# EAGLE design 8bitBusConcept (EAGLE 6.0)

## Sheet 1 of 2
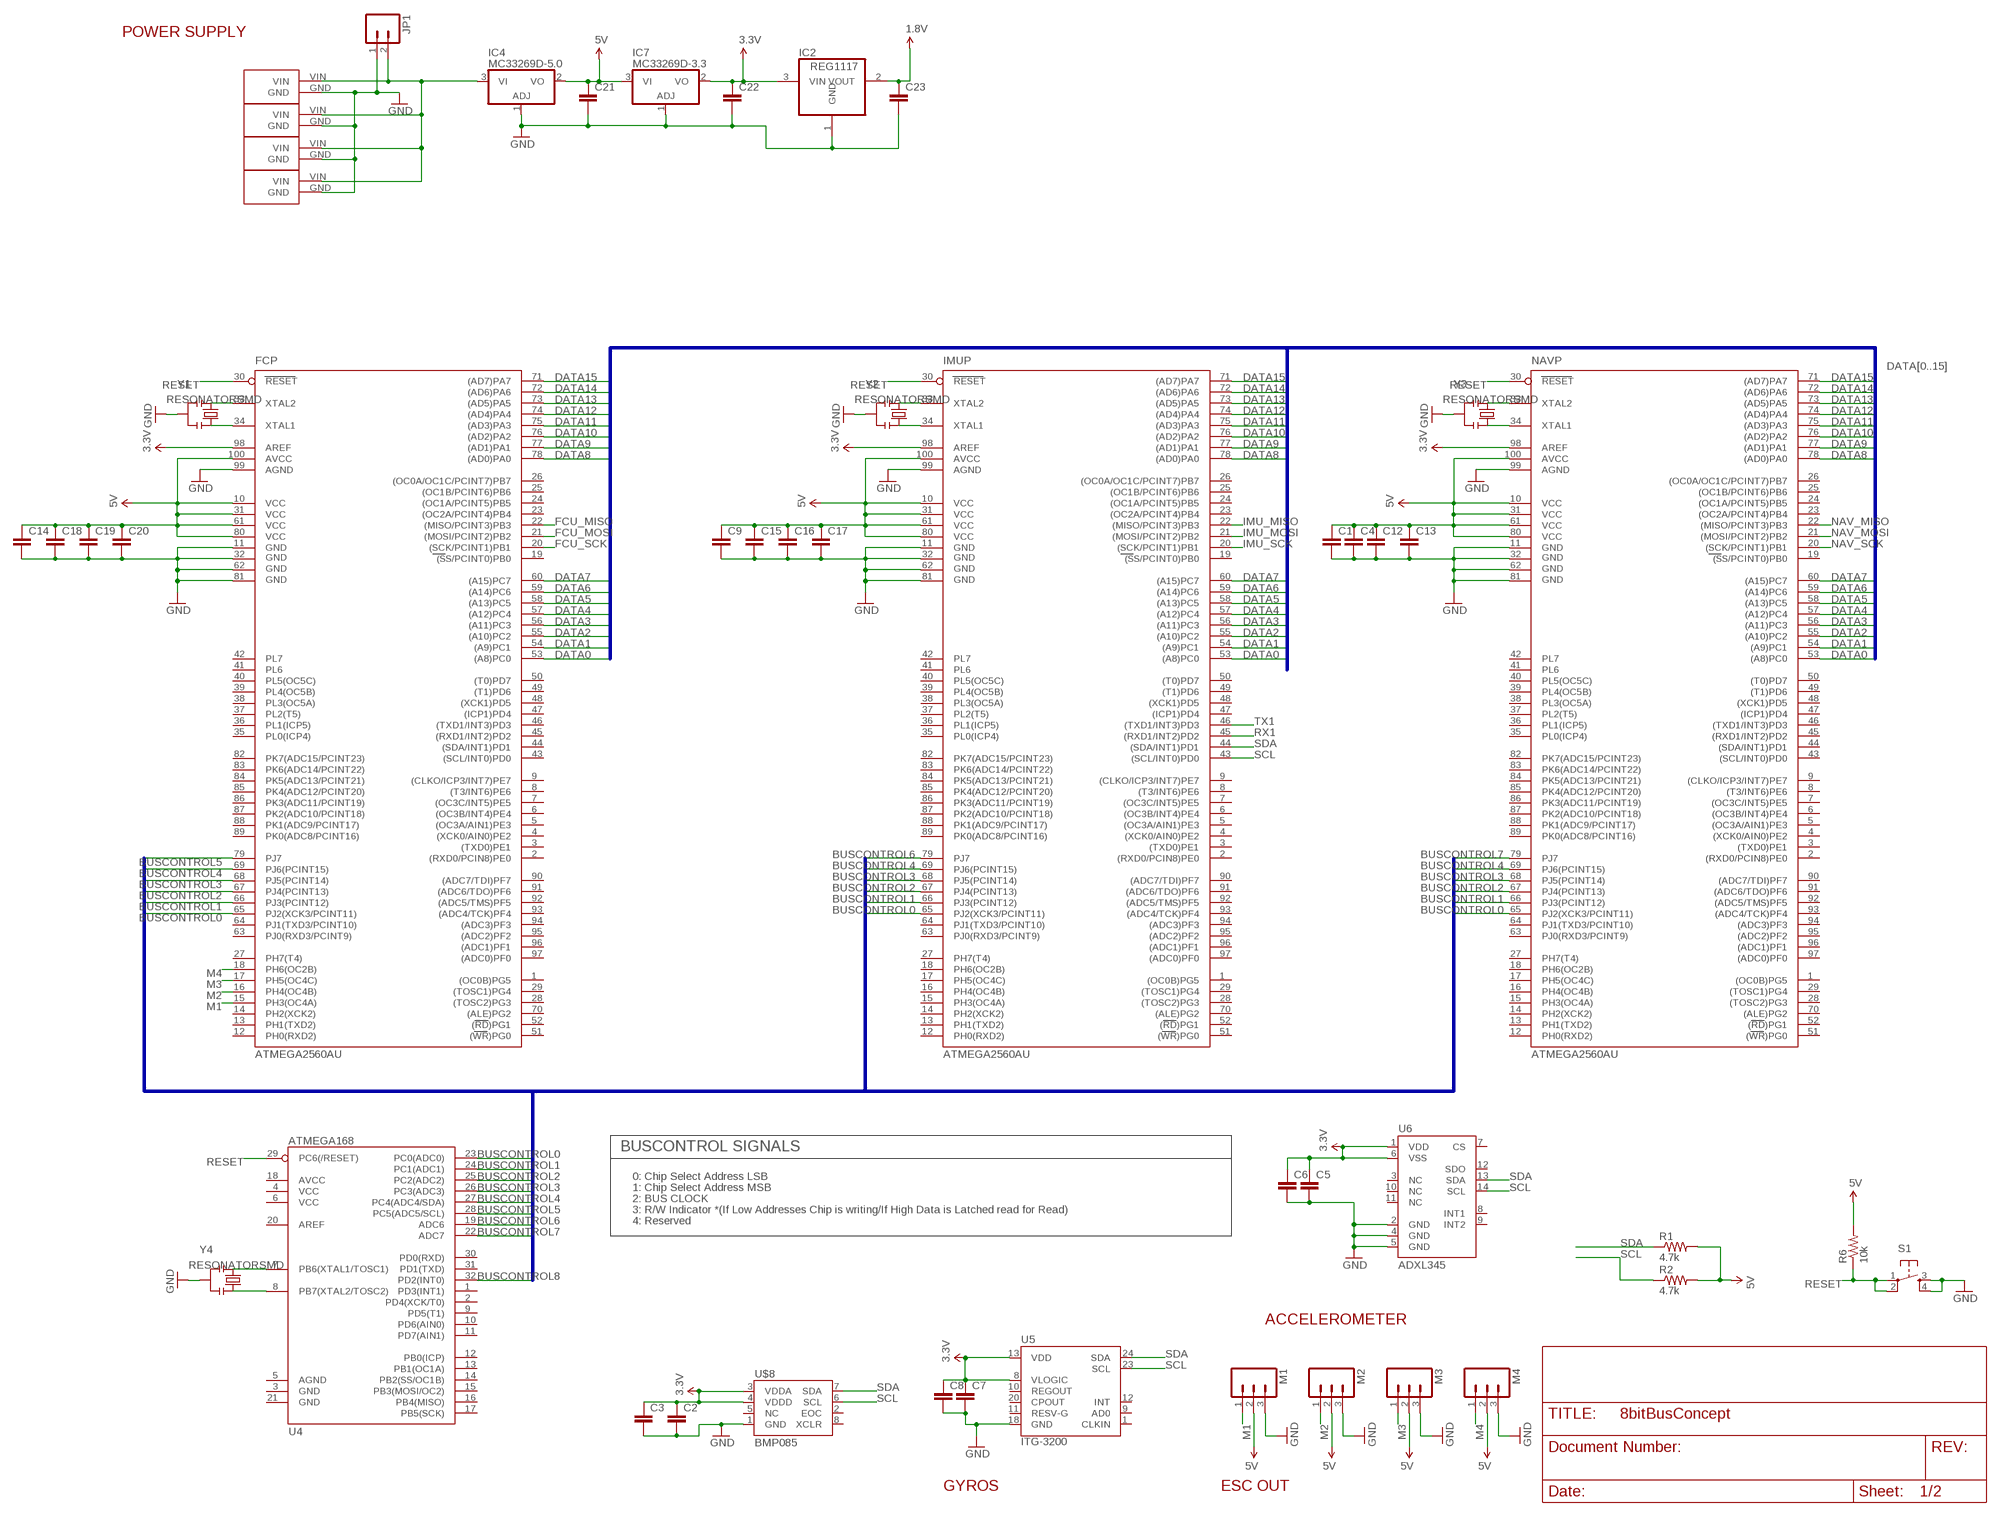
[diagram p0: schematic, sheet 1, part 1 of 2]
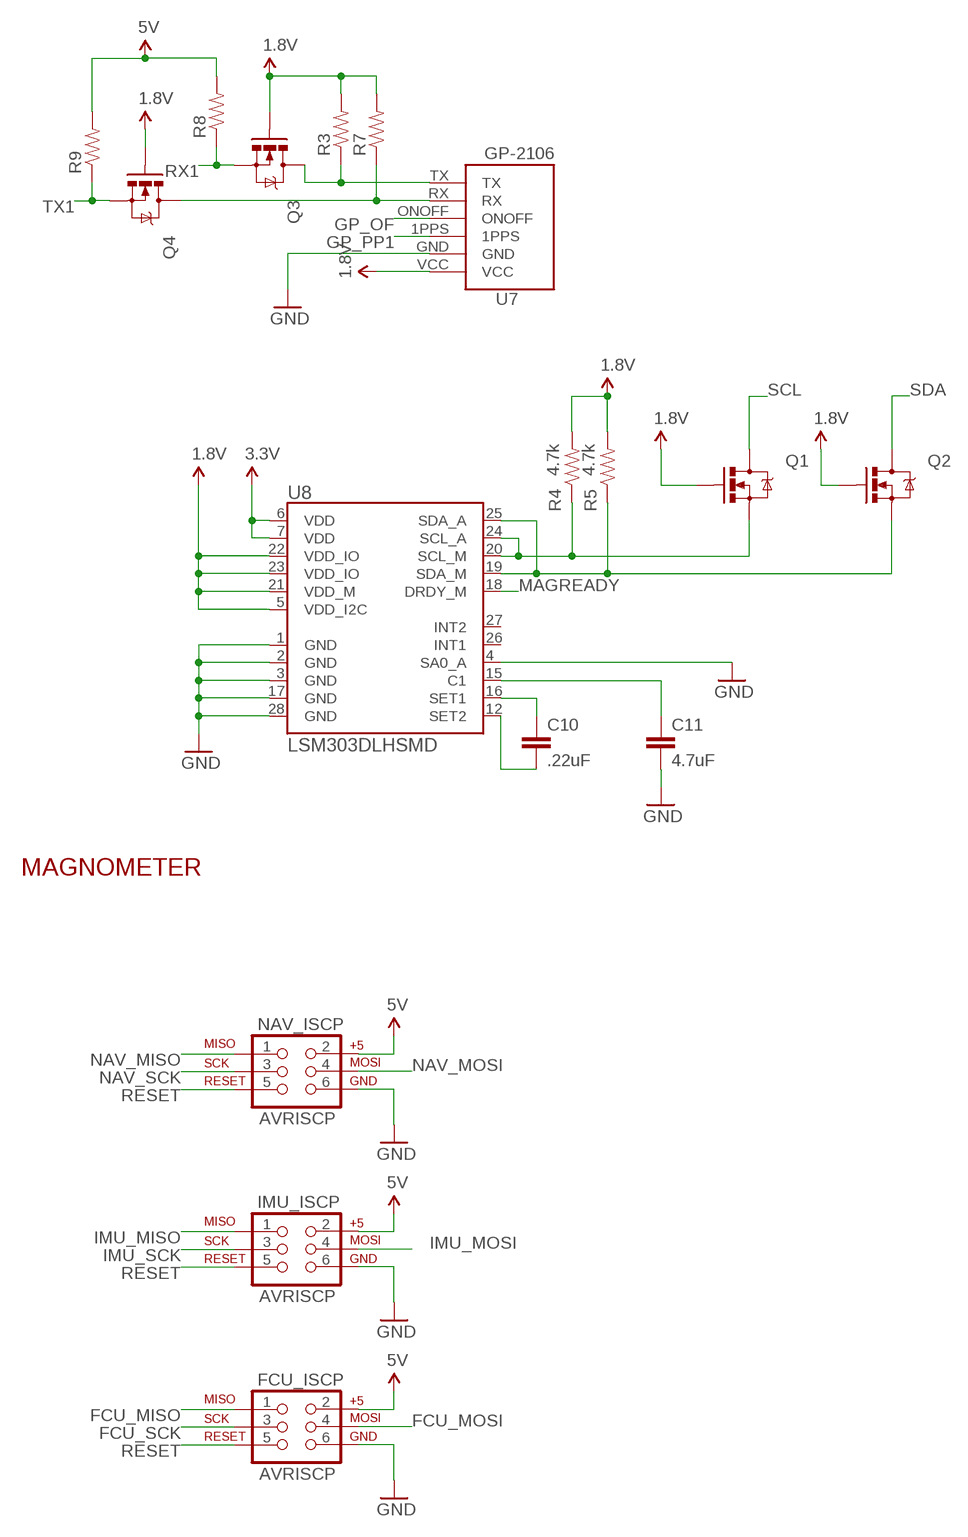
[diagram p1: schematic, sheet 1, part 2 of 2]

### Parts
C1  CAP0805  [0805]
C2  CAP0805  [0805]
C3  CAP0805  [0805]
C4  CAP0805  [0805]
C5  CAP0805  [0805]
C6  CAP0805  [0805]
C7  CAP0805  [0805]
C8  CAP0805  [0805]
C9  CAP0805  [0805]
C10  .22uF  CAP0805  [0805]
C11  4.7uF  CAP0805  [0805]
C12  CAP0805  [0805]
C13  CAP0805  [0805]
C14  CAP0805  [0805]
C15  CAP0805  [0805]
C16  CAP0805  [0805]
C17  CAP0805  [0805]
C18  CAP0805  [0805]
C19  CAP0805  [0805]
C20  CAP0805  [0805]
C21  CAP0805  [0805]
C22  CAP0805  [0805]
C23  CAP0805  [0805]
FCP  ATMEGA2560AU  [TQFP100]
FCU_ISCP  AVRISCP  AVR_SPI_PRG_6PTH  [2X3]
IC2  REG1117  [SOT223]
IC4  MC33269D-5.0  [DPACK]
IC7  MC33269D-3.3  [DPACK]
IMU_ISCP  AVRISCP  AVR_SPI_PRG_6PTH  [2X3]
IMUP  ATMEGA2560AU  [TQFP100]
JP1  M02PTH4  [1X02_XTRA_BIG]
M1  M03PTH  [1X03]
M2  M03PTH  [1X03]
M3  M03PTH  [1X03]
M4  M03PTH  [1X03]
NAV_ISCP  AVRISCP  AVR_SPI_PRG_6PTH  [2X3]
NAVP  ATMEGA2560AU  [TQFP100]
Q1  MOSFET-NCHANNELSMD  [SOT23-3]
Q2  MOSFET-NCHANNELSMD  [SOT23-3]
Q3  MOSFET-NCHANNELSMD  [SOT23-3]
Q4  MOSFET-NCHANNELSMD  [SOT23-3]
R1  4.7k  RESISTOR0805-RES  [0805]
R2  4.7k  RESISTOR0805-RES  [0805]
R3  RESISTOR0805-RES  [0805]
R4  4.7k  RESISTOR0805-RES  [0805]
R5  4.7k  RESISTOR0805-RES  [0805]
R6  10k  RESISTOR0805-RES  [0805]
R7  RESISTOR0805-RES  [0805]
R8  RESISTOR0805-RES  [0805]
R9  RESISTOR0805-RES  [0805]
S1  TAC_SWITCHSMD  [TACTILE_SWITCH_SMD]
U4  ATMEGA168  [TQFP32-08]
U5  ITG-3200  [QFN-24]
U6  ADXL345  [LGA14]
U7  GP-2106  [GP-2106]
U8  LSM303DLHSMD  [LGA28-5X5]
U$8  BMP085  [BMP085]
U$24  ESC_POWER  [ESCPOWER]
U$25  ESC_POWER  [ESCPOWER]
U$26  ESC_POWER  [ESCPOWER]
U$27  ESC_POWER  [ESCPOWER]
Y1  RESONATORSMD  [RESONATOR-SMD]
Y2  RESONATORSMD  [RESONATOR-SMD]
Y3  RESONATORSMD  [RESONATOR-SMD]
Y4  RESONATORSMD  [RESONATOR-SMD]

### Nets
1.8V: C23.1 IC2.2(VOUT) Q1.1(G) Q2.1(G) Q3.1(G) Q4.1(G) R3.2 R4.2 R5.2 R7.2 U7.VCC U8.5(VDD_I2C) U8.21(VDD_M) U8.22(VDD_IO) U8.23(VDD_IO)
3.3V: C2.1 C3.1 C5.1 C6.1 C7.1 C8.1 C22.1 FCP.98(AREF) IC2.3(VIN) IC7.2(VO) IMUP.98(AREF) NAVP.98(AREF) U5.8(VLOGIC) U5.13(VDD) U6.1(VDD) U6.6(VSS) U8.6(VDD) U8.7(VDD) U$8.3(VDDA) U$8.4(VDDD)
5V: C1.1 C4.1 C9.1 C12.1 C13.1 C14.1 C15.1 C16.1 C17.1 C18.1 C19.1 C20.1 C21.1 FCP.10(VCC) FCP.31(VCC1) FCP.61(VCC2) FCP.80(VCC3) FCP.100(AVCC) FCU_ISCP.2 IC4.2(VO) IC7.3(VI) IMU_ISCP.2 IMUP.10(VCC) IMUP.31(VCC1) IMUP.61(VCC2) IMUP.80(VCC3) IMUP.100(AVCC) M1.2 M2.2 M3.2 M4.2 NAV_ISCP.2 NAVP.10(VCC) NAVP.31(VCC1) NAVP.61(VCC2) NAVP.80(VCC3) NAVP.100(AVCC) R1.2 R2.2 R6.2 R8.2 R9.2
BUSCONTROL0: FCP.65(PJ2(XCK3/PCINT11)) IMUP.65(PJ2(XCK3/PCINT11)) NAVP.65(PJ2(XCK3/PCINT11)) U4.23(PC0(ADC0))
BUSCONTROL1: FCP.66(PJ3(PCINT12)) IMUP.66(PJ3(PCINT12)) NAVP.66(PJ3(PCINT12)) U4.24(PC1(ADC1))
BUSCONTROL2: FCP.67(PJ4(PCINT13)) IMUP.67(PJ4(PCINT13)) NAVP.67(PJ4(PCINT13)) U4.25(PC2(ADC2))
BUSCONTROL3: FCP.68(PJ5(PCINT14)) IMUP.68(PJ5(PCINT14)) NAVP.68(PJ5(PCINT14)) U4.26(PC3(ADC3))
BUSCONTROL4: FCP.69(PJ6(PCINT15)) IMUP.69(PJ6(PCINT15)) NAVP.69(PJ6(PCINT15)) U4.27(PC4(ADC4/SDA))
BUSCONTROL5: FCP.79(PJ7) U4.28(PC5(ADC5/SCL))
BUSCONTROL6: IMUP.79(PJ7) U4.19(ADC6)
BUSCONTROL7: NAVP.79(PJ7) U4.22(ADC7)
BUSCONTROL8: U4.32(PD2(INT0))
DATA0: FCP.53((A8)PC0) IMUP.53((A8)PC0) NAVP.53((A8)PC0)
DATA1: FCP.54((A9)PC1) IMUP.54((A9)PC1) NAVP.54((A9)PC1)
DATA2: FCP.55((A10)PC2) IMUP.55((A10)PC2) NAVP.55((A10)PC2)
DATA3: FCP.56((A11)PC3) IMUP.56((A11)PC3) NAVP.56((A11)PC3)
DATA4: FCP.57((A12)PC4) IMUP.57((A12)PC4) NAVP.57((A12)PC4)
DATA5: FCP.58((A13)PC5) IMUP.58((A13)PC5) NAVP.58((A13)PC5)
DATA6: FCP.59((A14)PC6) IMUP.59((A14)PC6) NAVP.59((A14)PC6)
DATA7: FCP.60((A15)PC7) IMUP.60((A15)PC7) NAVP.60((A15)PC7)
DATA8: FCP.78((AD0)PA0) IMUP.78((AD0)PA0) NAVP.78((AD0)PA0)
DATA9: FCP.77((AD1)PA1) IMUP.77((AD1)PA1) NAVP.77((AD1)PA1)
DATA10: FCP.76((AD2)PA2) IMUP.76((AD2)PA2) NAVP.76((AD2)PA2)
DATA11: FCP.75((AD3)PA3) IMUP.75((AD3)PA3) NAVP.75((AD3)PA3)
DATA12: FCP.74((AD4)PA4) IMUP.74((AD4)PA4) NAVP.74((AD4)PA4)
DATA13: FCP.73((AD5)PA5) IMUP.73((AD5)PA5) NAVP.73((AD5)PA5)
DATA14: FCP.72((AD6)PA6) IMUP.72((AD6)PA6) NAVP.72((AD6)PA6)
DATA15: FCP.71((AD7)PA7) IMUP.71((AD7)PA7) NAVP.71((AD7)PA7)
FCU_MISO: FCP.22((MISO/PCINT3)PB3) FCU_ISCP.1
FCU_MOSI: FCP.21((MOSI/PCINT2)PB2) FCU_ISCP.4
FCU_SCK: FCP.20((SCK/PCINT1)PB1) FCU_ISCP.3
GND: C1.2 C2.2 C3.2 C4.2 C5.2 C6.2 C7.2 C8.2 C9.2 C11.2 C12.2 C13.2 C14.2 C15.2 C16.2 C17.2 C18.2 C19.2 C20.2 C21.2 C22.2 C23.2 FCP.11(GND) FCP.32(GND1) FCP.62(GND2) FCP.81(GND3) FCP.99(AGND) FCU_ISCP.6 IC2.1(GND) IC4.1(ADJ) IC7.1(ADJ) IMU_ISCP.6 IMUP.11(GND) IMUP.32(GND1) IMUP.62(GND2) IMUP.81(GND3) IMUP.99(AGND) JP1.1 M1.3 M2.3 M3.3 M4.3 NAV_ISCP.6 NAVP.11(GND) NAVP.32(GND1) NAVP.62(GND2) NAVP.81(GND3) NAVP.99(AGND) S1.3 S1.4 U5.18(GND) U6.2(GND) U6.4(GND) U6.5(GND) U7.GND U8.1(GND) U8.2(GND) U8.3(GND) U8.4(SA0_A) U8.17(GND) U8.28(GND) U$8.1(GND) U$24.GND U$25.GND U$26.GND U$27.GND Y1.2 Y2.2 Y3.2 Y4.2
GP_OF: U7.ONOFF
GP_PP1: U7.1PPS
IMU_MISO: IMU_ISCP.1 IMUP.22((MISO/PCINT3)PB3)
IMU_MOSI: IMU_ISCP.4 IMUP.21((MOSI/PCINT2)PB2)
IMU_SCK: IMU_ISCP.3 IMUP.20((SCK/PCINT1)PB1)
M1: FCP.15(PH3(OC4A)) M1.1
M2: FCP.16(PH4(OC4B)) M2.1
M3: FCP.17(PH5(OC4C)) M3.1
M4: FCP.18(PH6(OC2B)) M4.1
MAGREADY: U8.18(DRDY_M)
N$1: FCP.33(XTAL2) Y1.1
N$2: FCP.34(XTAL1) Y1.3
N$3: IMUP.33(XTAL2) Y2.1
N$4: IMUP.34(XTAL1) Y2.3
N$5: NAVP.33(XTAL2) Y3.1
N$6: NAVP.34(XTAL1) Y3.3
N$7: U4.7(PB6(XTAL1/TOSC1)) Y4.1
N$8: U4.8(PB7(XTAL2/TOSC2)) Y4.3
N$9: Q3.3(D) R3.1 U7.TX
N$10: Q4.3(D) R7.1 U7.RX
N$11: Q2.2(S) R5.1 U8.19(SDA_M) U8.25(SDA_A)
N$12: Q1.2(S) R4.1 U8.20(SCL_M) U8.24(SCL_A)
N$13: C11.1 U8.15(C1)
N$14: C10.1 U8.16(SET1)
N$15: C10.2 U8.12(SET2)
NAV_MISO: NAV_ISCP.1 NAVP.22((MISO/PCINT3)PB3)
NAV_MOSI: NAV_ISCP.4 NAVP.21((MOSI/PCINT2)PB2)
NAV_SCK: NAV_ISCP.3 NAVP.20((SCK/PCINT1)PB1)
RESET: FCP.30(RESET) FCU_ISCP.5 IMU_ISCP.5 IMUP.30(RESET) NAV_ISCP.5 NAVP.30(RESET) R6.1 S1.1 S1.2 U4.29(PC6(/RESET))
RX1: IMUP.45((RXD1/INT2)PD2) Q3.2(S) R8.1
SCL: IMUP.43((SCL/INT0)PD0) Q1.3(D) R2.1 U5.23(SCL) U6.14(SCL) U$8.6(SCL)
SDA: IMUP.44((SDA/INT1)PD1) Q2.3(D) R1.1 U5.24(SDA) U6.13(SDA) U$8.7(SDA)
TX1: IMUP.46((TXD1/INT3)PD3) Q4.2(S) R9.1
VIN [POWER]: IC4.3(VI) JP1.2 U$24.VIN U$25.VIN U$26.VIN U$27.VIN
Unconnected: FCP.1((OC0B)PG5) FCP.2((RXD0/PCIN8)PE0) FCP.3((TXD0)PE1) FCP.4((XCK0/AIN0)PE2) FCP.5((OC3A/AIN1)PE3) FCP.6((OC3B/INT4)PE4) FCP.7((OC3C/INT5)PE5) FCP.8((T3/INT6)PE6) FCP.9((CLKO/ICP3/INT7)PE7) FCP.12(PH0(RXD2)) FCP.13(PH1(TXD2)) FCP.14(PH2(XCK2)) FCP.19((SS/PCINT0)PB0) FCP.23((OC2A/PCINT4)PB4) FCP.24((OC1A/PCINT5)PB5) FCP.25((OC1B/PCINT6)PB6) FCP.26((OC0A/OC1C/PCINT7)PB7) FCP.27(PH7(T4)) FCP.28((TOSC2)PG3) FCP.29((TOSC1)PG4) FCP.35(PL0(ICP4)) FCP.36(PL1(ICP5)) FCP.37(PL2(T5)) FCP.38(PL3(OC5A)) FCP.39(PL4(OC5B)) FCP.40(PL5(OC5C)) FCP.41(PL6) FCP.42(PL7) FCP.43((SCL/INT0)PD0) FCP.44((SDA/INT1)PD1) FCP.45((RXD1/INT2)PD2) FCP.46((TXD1/INT3)PD3) FCP.47((ICP1)PD4) FCP.48((XCK1)PD5) FCP.49((T1)PD6) FCP.50((T0)PD7) FCP.51((WR)PG0) FCP.52((RD)PG1) FCP.63(PJ0(RXD3/PCINT9)) FCP.64(PJ1(TXD3/PCINT10)) FCP.70((ALE)PG2) FCP.82(PK7(ADC15/PCINT23)) FCP.83(PK6(ADC14/PCINT22)) FCP.84(PK5(ADC13/PCINT21)) FCP.85(PK4(ADC12/PCINT20)) FCP.86(PK3(ADC11/PCINT19)) FCP.87(PK2(ADC10/PCINT18)) FCP.88(PK1(ADC9/PCINT17)) FCP.89(PK0(ADC8/PCINT16)) FCP.90((ADC7/TDI)PF7) FCP.91((ADC6/TDO)PF6) FCP.92((ADC5/TMS)PF5) FCP.93((ADC4/TCK)PF4) FCP.94((ADC3)PF3) FCP.95((ADC2)PF2) FCP.96((ADC1)PF1) FCP.97((ADC0)PF0) IMUP.1((OC0B)PG5) IMUP.2((RXD0/PCIN8)PE0) IMUP.3((TXD0)PE1) IMUP.4((XCK0/AIN0)PE2) IMUP.5((OC3A/AIN1)PE3) IMUP.6((OC3B/INT4)PE4) IMUP.7((OC3C/INT5)PE5) IMUP.8((T3/INT6)PE6) IMUP.9((CLKO/ICP3/INT7)PE7) IMUP.12(PH0(RXD2)) IMUP.13(PH1(TXD2)) IMUP.14(PH2(XCK2)) IMUP.15(PH3(OC4A)) IMUP.16(PH4(OC4B)) IMUP.17(PH5(OC4C)) IMUP.18(PH6(OC2B)) IMUP.19((SS/PCINT0)PB0) IMUP.23((OC2A/PCINT4)PB4) IMUP.24((OC1A/PCINT5)PB5) IMUP.25((OC1B/PCINT6)PB6) IMUP.26((OC0A/OC1C/PCINT7)PB7) IMUP.27(PH7(T4)) IMUP.28((TOSC2)PG3) IMUP.29((TOSC1)PG4) IMUP.35(PL0(ICP4)) IMUP.36(PL1(ICP5)) IMUP.37(PL2(T5)) IMUP.38(PL3(OC5A)) IMUP.39(PL4(OC5B)) IMUP.40(PL5(OC5C)) IMUP.41(PL6) IMUP.42(PL7) IMUP.47((ICP1)PD4) IMUP.48((XCK1)PD5) IMUP.49((T1)PD6) IMUP.50((T0)PD7) IMUP.51((WR)PG0) IMUP.52((RD)PG1) IMUP.63(PJ0(RXD3/PCINT9)) IMUP.64(PJ1(TXD3/PCINT10)) IMUP.70((ALE)PG2) IMUP.82(PK7(ADC15/PCINT23)) IMUP.83(PK6(ADC14/PCINT22)) IMUP.84(PK5(ADC13/PCINT21)) IMUP.85(PK4(ADC12/PCINT20)) IMUP.86(PK3(ADC11/PCINT19)) IMUP.87(PK2(ADC10/PCINT18)) IMUP.88(PK1(ADC9/PCINT17)) IMUP.89(PK0(ADC8/PCINT16)) IMUP.90((ADC7/TDI)PF7) IMUP.91((ADC6/TDO)PF6) IMUP.92((ADC5/TMS)PF5) IMUP.93((ADC4/TCK)PF4) IMUP.94((ADC3)PF3) IMUP.95((ADC2)PF2) IMUP.96((ADC1)PF1) IMUP.97((ADC0)PF0) NAVP.1((OC0B)PG5) NAVP.2((RXD0/PCIN8)PE0) NAVP.3((TXD0)PE1) NAVP.4((XCK0/AIN0)PE2) NAVP.5((OC3A/AIN1)PE3) NAVP.6((OC3B/INT4)PE4) NAVP.7((OC3C/INT5)PE5) NAVP.8((T3/INT6)PE6) NAVP.9((CLKO/ICP3/INT7)PE7) NAVP.12(PH0(RXD2)) NAVP.13(PH1(TXD2)) NAVP.14(PH2(XCK2)) NAVP.15(PH3(OC4A)) NAVP.16(PH4(OC4B)) NAVP.17(PH5(OC4C)) NAVP.18(PH6(OC2B)) NAVP.19((SS/PCINT0)PB0) NAVP.23((OC2A/PCINT4)PB4) NAVP.24((OC1A/PCINT5)PB5) NAVP.25((OC1B/PCINT6)PB6) NAVP.26((OC0A/OC1C/PCINT7)PB7) NAVP.27(PH7(T4)) NAVP.28((TOSC2)PG3) NAVP.29((TOSC1)PG4) NAVP.35(PL0(ICP4)) NAVP.36(PL1(ICP5)) NAVP.37(PL2(T5)) NAVP.38(PL3(OC5A)) NAVP.39(PL4(OC5B)) NAVP.40(PL5(OC5C)) NAVP.41(PL6) NAVP.42(PL7) NAVP.43((SCL/INT0)PD0) NAVP.44((SDA/INT1)PD1) NAVP.45((RXD1/INT2)PD2) NAVP.46((TXD1/INT3)PD3) NAVP.47((ICP1)PD4) NAVP.48((XCK1)PD5) NAVP.49((T1)PD6) NAVP.50((T0)PD7) NAVP.51((WR)PG0) NAVP.52((RD)PG1) NAVP.63(PJ0(RXD3/PCINT9)) NAVP.64(PJ1(TXD3/PCINT10)) NAVP.70((ALE)PG2) NAVP.82(PK7(ADC15/PCINT23)) NAVP.83(PK6(ADC14/PCINT22)) NAVP.84(PK5(ADC13/PCINT21)) NAVP.85(PK4(ADC12/PCINT20)) NAVP.86(PK3(ADC11/PCINT19)) NAVP.87(PK2(ADC10/PCINT18)) NAVP.88(PK1(ADC9/PCINT17)) NAVP.89(PK0(ADC8/PCINT16)) NAVP.90((ADC7/TDI)PF7) NAVP.91((ADC6/TDO)PF6) NAVP.92((ADC5/TMS)PF5) NAVP.93((ADC4/TCK)PF4) NAVP.94((ADC3)PF3) NAVP.95((ADC2)PF2) NAVP.96((ADC1)PF1) NAVP.97((ADC0)PF0) U4.1(PD3(INT1)) U4.2(PD4(XCK/T0)) U4.3(GND) U4.4(VCC) U4.5(AGND) U4.6(VCC) U4.9(PD5(T1)) U4.10(PD6(AIN0)) U4.11(PD7(AIN1)) U4.12(PB0(ICP)) U4.13(PB1(OC1A)) U4.14(PB2(SS/OC1B)) U4.15(PB3(MOSI/OC2)) U4.16(PB4(MISO)) U4.17(PB5(SCK)) U4.18(AVCC) U4.20(AREF) U4.21(GND) U4.30(PD0(RXD)) U4.31(PD1(TXD)) U5.1(CLKIN) U5.9(AD0) U5.10(REGOUT) U5.11(RESV-G) U5.12(INT) U5.20(CPOUT) U6.3(NC) U6.7(CS) U6.8(INT1) U6.9(INT2) U6.10(NC) U6.11(NC) U6.12(SDO) U8.26(INT1) U8.27(INT2) U$8.2(EOC) U$8.5(NC) U$8.8(XCLR)

### Buses
DATA[0..15]
BUSCONTROL[0..8]

### Notes on the sheet
- POWER SUPPLY
- MAGNOMETER
- BUSCONTROL SIGNALS
- 0: Chip Select Address LSB
- 1: Chip Select Address MSB
- 2: BUS CLOCK
- 3: R/W Indicator *(If Low Addresses Chip is writing/If High Data is Latched read for Read)
- 4: Reserved
- ACCELEROMETER
- GYROS | ESC OUT

## Sheet 2 of 2

## Library data of the parts
C1-C23 = SparkFun:CAP: Capacitor Standard 0603 ceramic capacitor, and 0.1" leaded capacitor.
FCP IMUP NAVP = SparkFun:ATMEGA2560: MICROCONTROLLER 64/128/256 Kbytes FLASH 4 Kbytes EEPROM 8 Kbytes SRAM 86 General Purpose I/O pins 12-channels16-bit PWM 4 x Serial USARTs 16-channels 10-bit A/D
FCU_ISCP IMU_ISCP NAV_ISCP = SparkFun:AVR_SPI_PRG_6: AVR ISP 6 Pin This is the reduced ISP connector for AVR programming. Common on Arduino. This footprint will take up less PCB space and can be used with a 10-pin to 6-pin adapter such as SKU: BOB-08508
IC2 = burr-brown:REG1117: 800mA and 1A Low Dropout (LDO) Positive Regulator 1.8V, 2.5V, 2.85V, 3.3V, 5V, and Adj; MPN: REG1117; OC_FARNELL: 1097566; OC_NEWARK: 14P6981
IC4 IC7 = linear:MC33269?*: Adjustable Output Low Dropout Voltage Regulator 800 mA Source: http://www.onsemi.com/pub/Collateral/MC33269-D.PDF
JP1 = SparkFun:M02: Header 2 Standard 2-pin 0.1" header. Use with straight break away headers (SKU : PRT-00116), right angle break away headers (PRT-00553), swiss pins (PRT-00743), machine pins (PRT-00117), and female headers (PRT-00115). Molex polarized connector foot print use with SKU : PRT-08233 with associated crimp pins and housings.
M1-M4 = SparkFun:M03: Header 3 Standard 3-pin 0.1" header. Use with straight break away headers (SKU : PRT-00116), right angle break away headers (PRT-00553), swiss pins (PRT-00743), machine pins (PRT-00117), and female headers (PRT-00115). Molex polarized connector foot print use with SKU : PRT-08232 with associated crimp pins and housings.
Q1-Q4 = SparkFun:MOSFET-NCHANNEL
R1-R9 = SparkFun:RESISTOR: Resistor Basic schematic elements and footprints for 0603, 1206, and PTH resistors.
S1 = SparkFun:TAC_SWITCH: Momentary Switch Button commonly used for reset or general input. Spark Fun Electronics SKU : COM-00097
U4 = SparkFun:ATMEGA168
U5 = SparkFun:ITG-3200: ITG-3200 3-axis gyro, digital output, qfn24 package
U6 = SparkFun:ADXL345
U7 = SparkFun:GP-2106: GP-2106 GPS SiRF IV
U8 = SparkFun:LSM303DLH
U$8 = SparkFun:BMP085: BMP085 Pressure Sensor Great little MEMS pressure sensor. SKU: COM-09603
U$24-U$27 = terrys:ESC_POWER
Y1-Y4 = SparkFun:RESONATOR: Resonator Small SMD resonator. This is the itty bitty 10/20MHz resonators with built in caps. CSTCE10M0G55 and CSTCE20M0V53. Footprint has been reviewed closely but hasn't been tested yet.

## Net classes
1 POWER: width 0.508 mm, drill 0.406 mm, clearance 0.254 mm

## Board
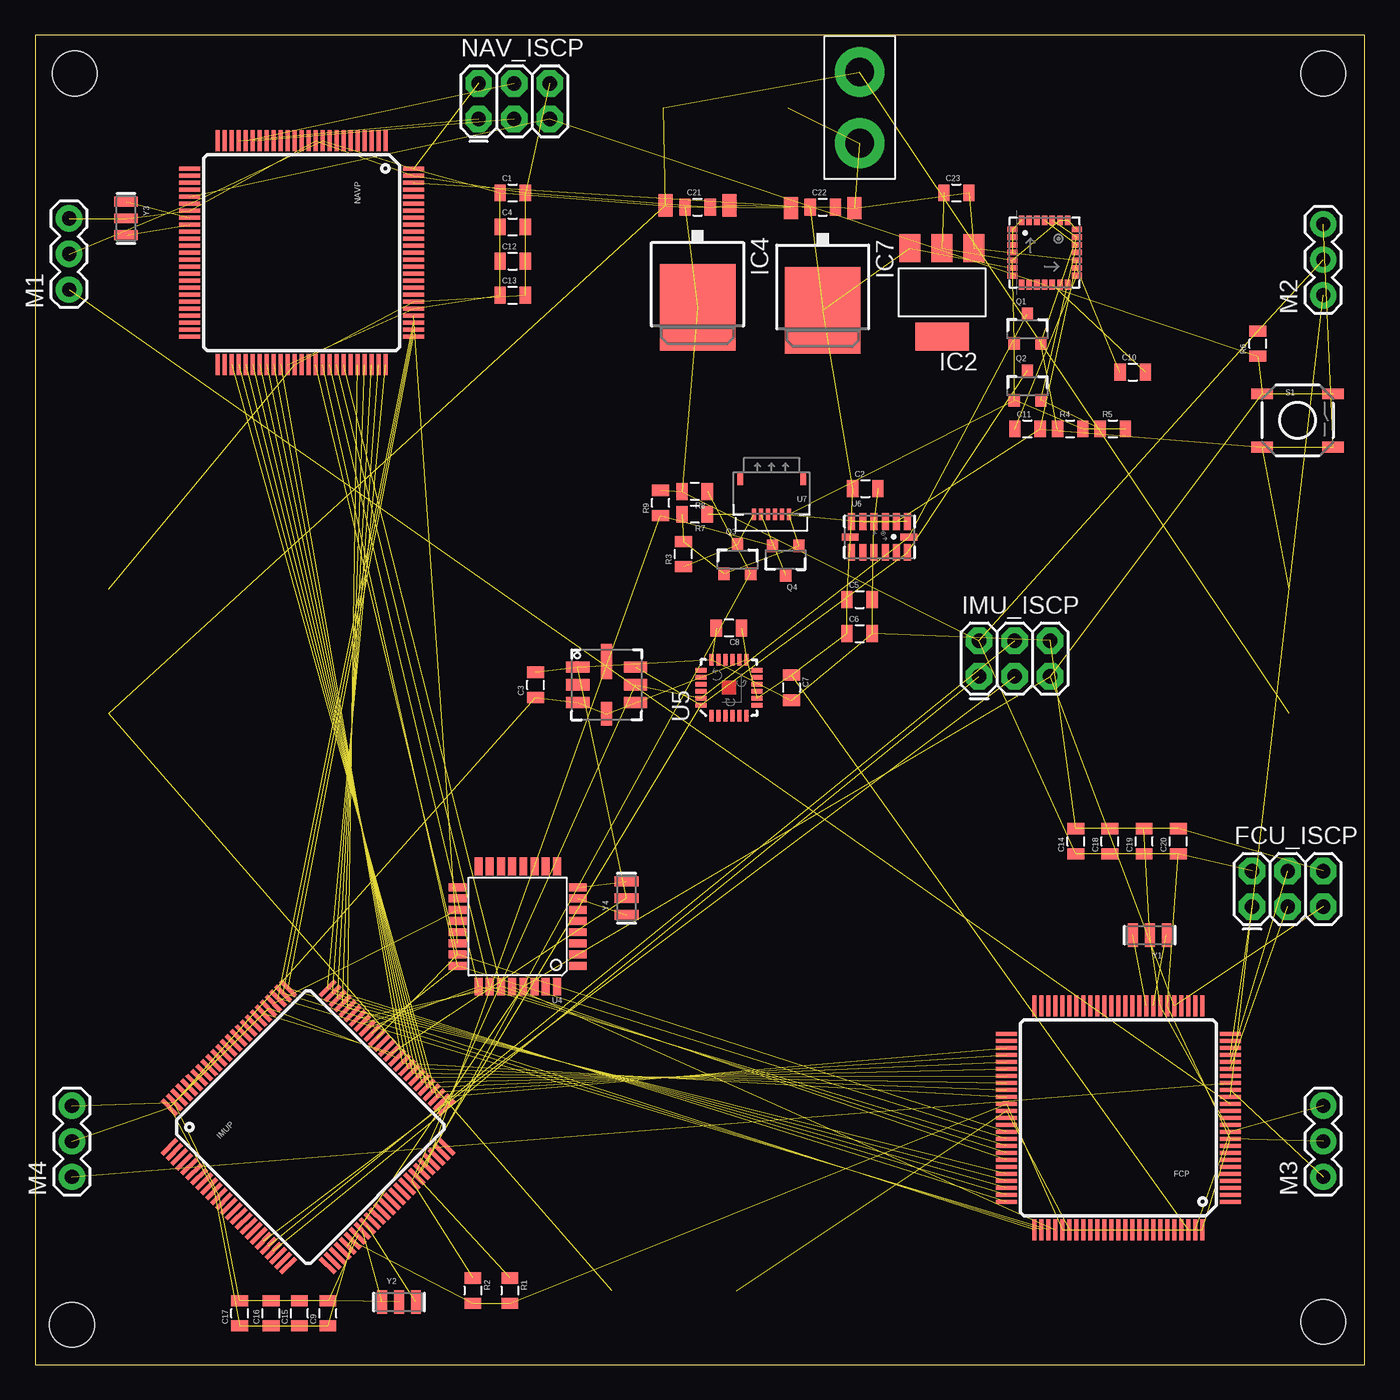
[diagram p2: board, top side]
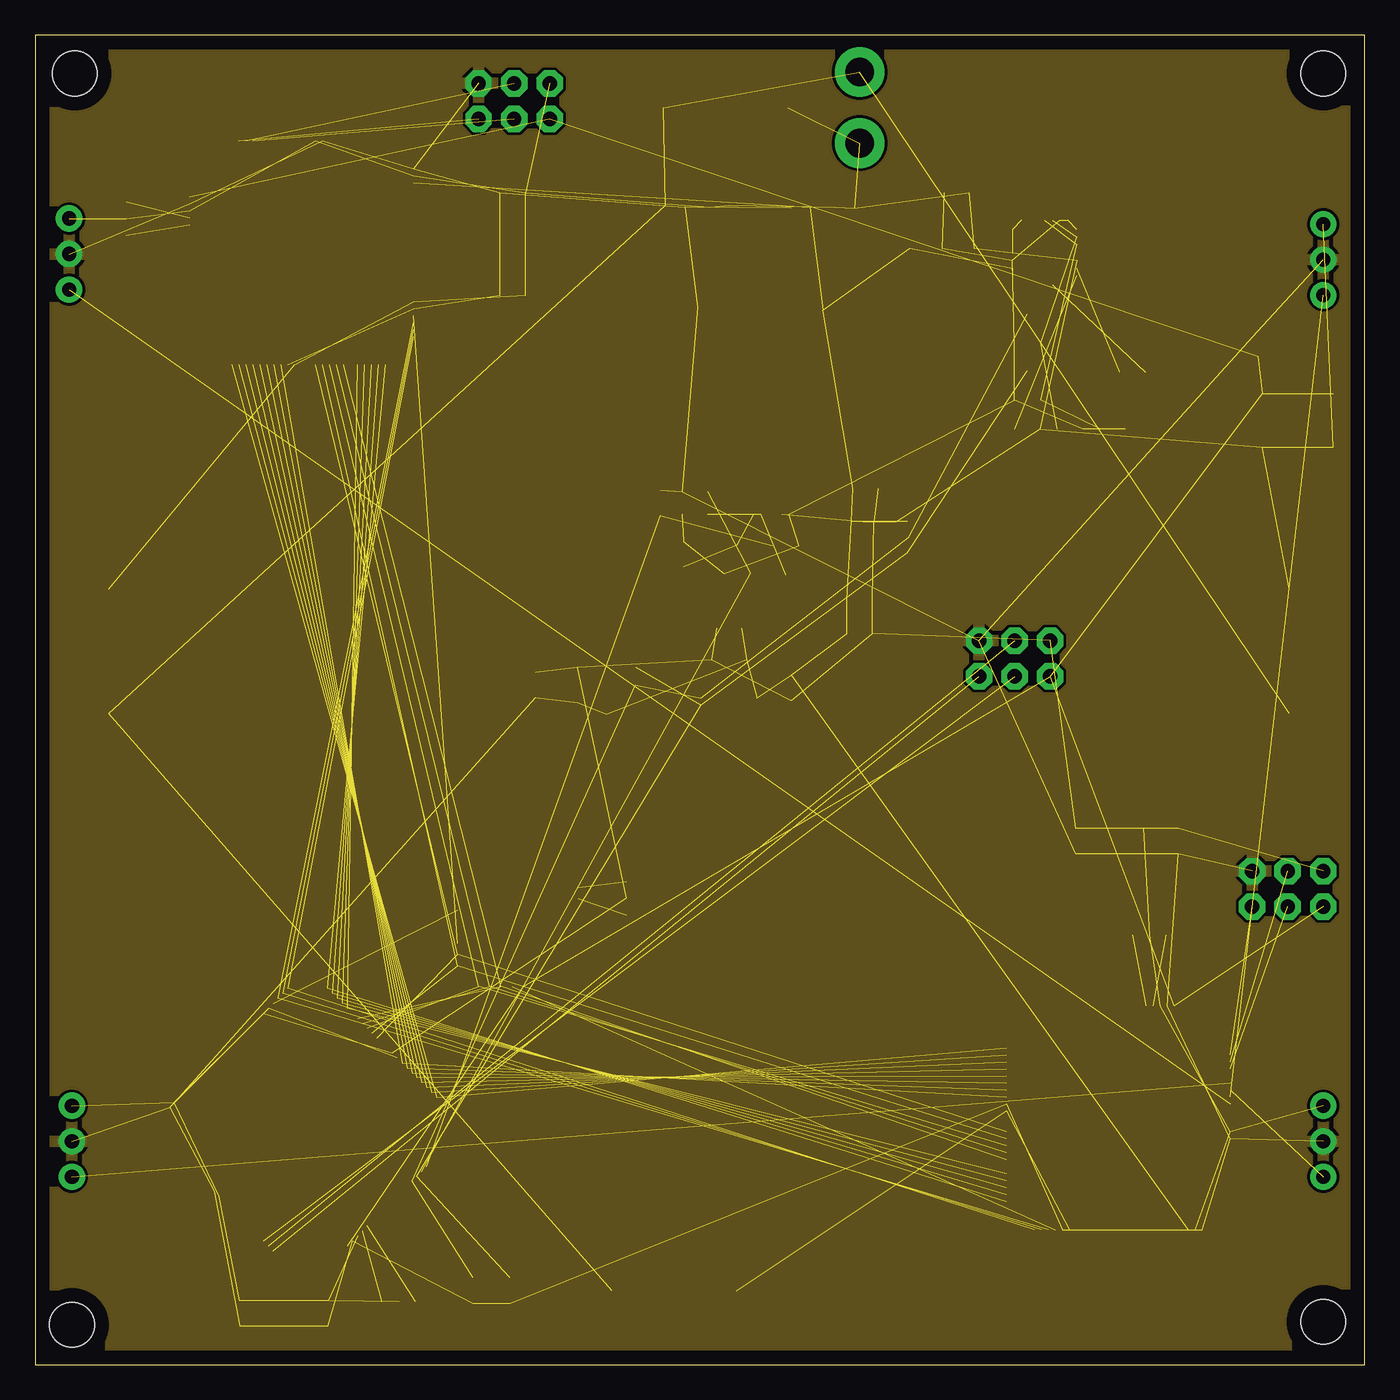
[diagram p3: board, inner layer GND]
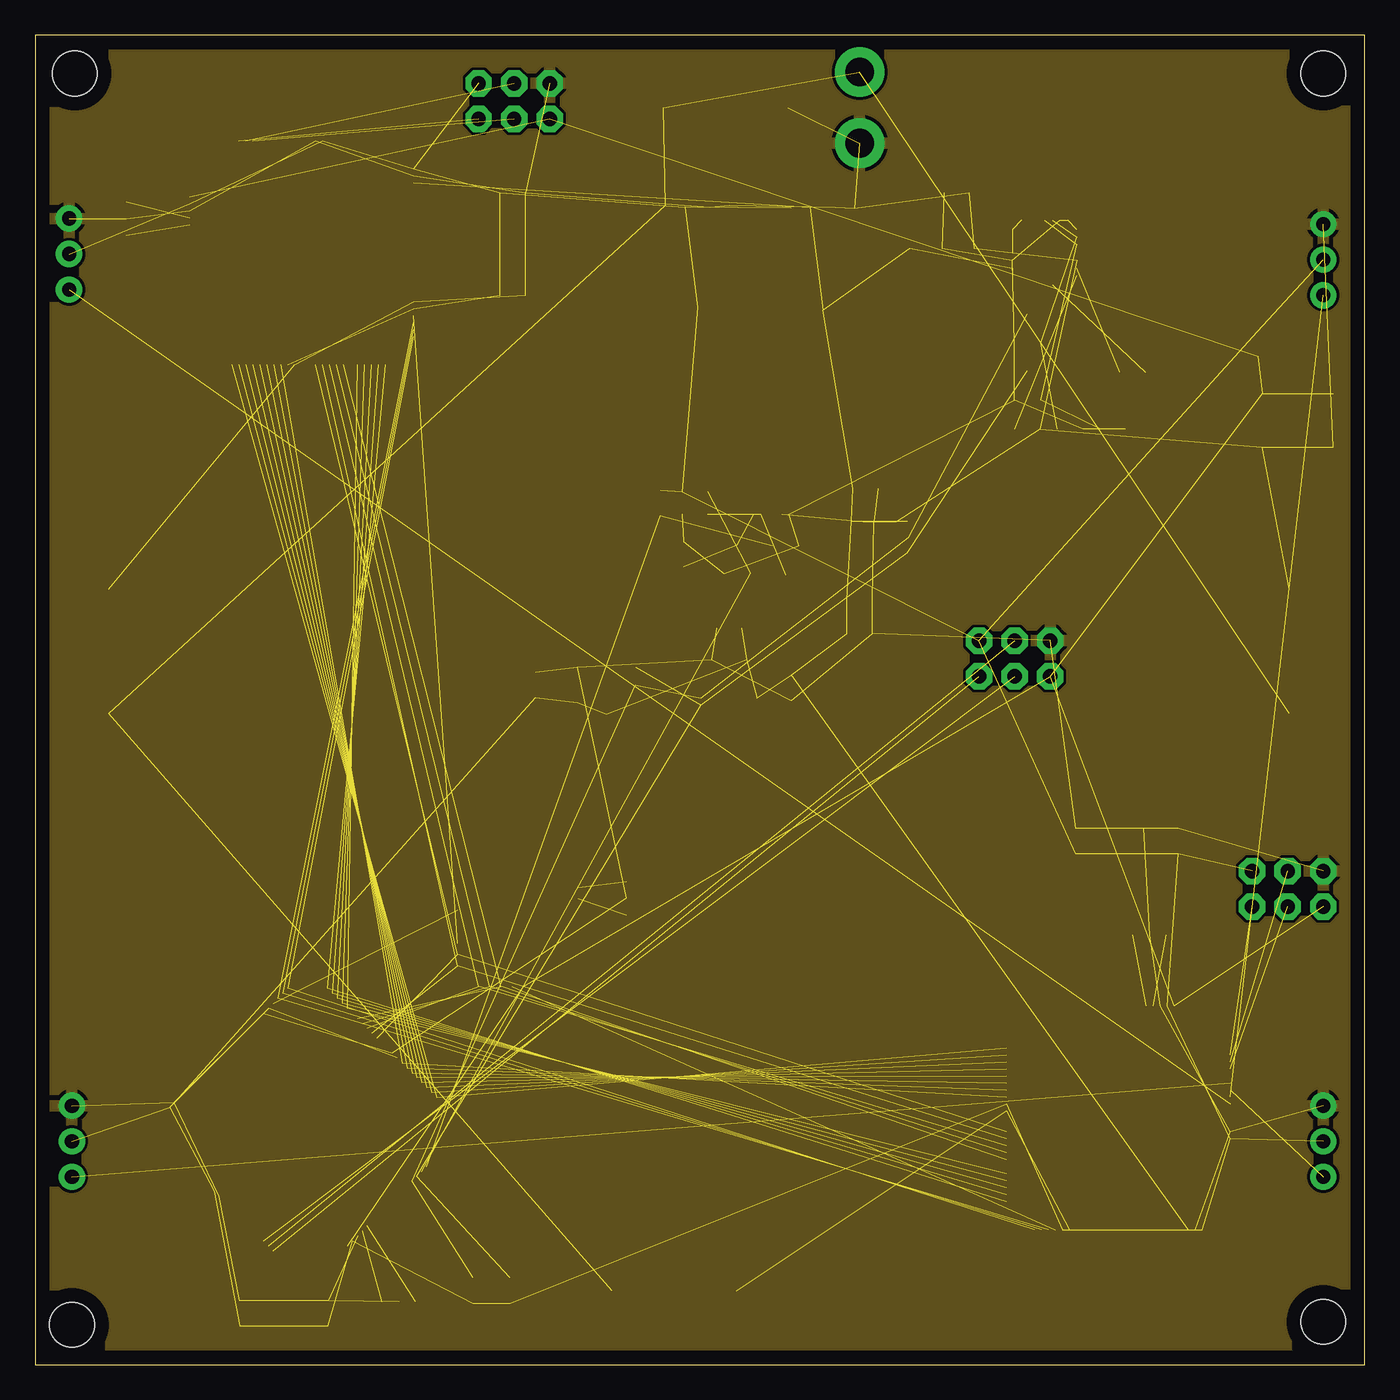
[diagram p4: board, inner layer Route15]
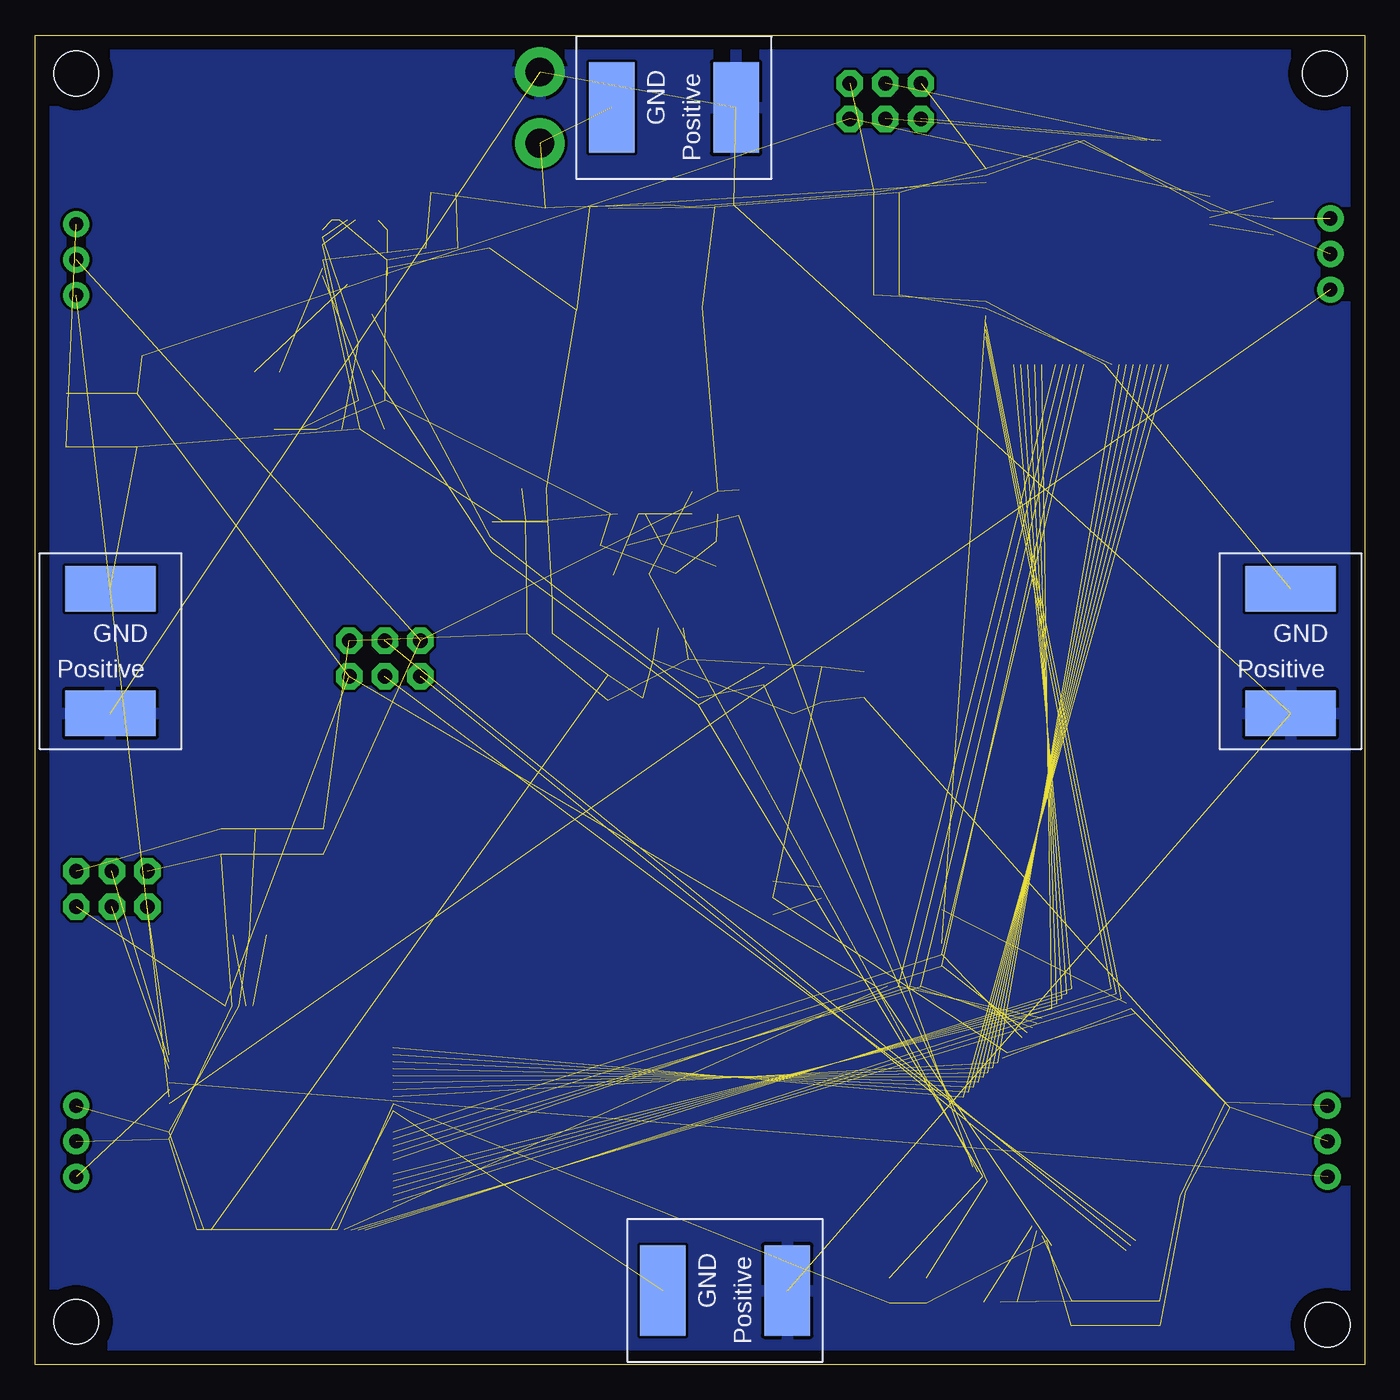
[diagram p5: board, bottom side, seen from below]

Size 95 x 95 mm. Coordinates in mm from the lower left corner, seen from the top.
Outline: 0,0 95,0 95,95 0,95 0,0
Copper layers [15:1+2+(15*16)]: Top 0.035mm / dielectric 0.15mm / GND 0.035mm / dielectric 0.15mm / Route15 0.035mm / dielectric 0.2mm / Bottom 0.035mm
Design rules: minimum track width 10mil, minimum drill 24mil, track to track 8mil, track to pad 8mil, pad to pad 8mil, via to via 8mil, smd to smd 8mil, copper to edge 40mil, drill to drill 8mil, minimum pad ring 10mil, minimum via ring 8mil, stop-mask expansion 4mil, vias tented up to drill 0mil, thermal gap 10mil
Holes 3.2 mm at 2.84,92.25 92.05,92.25 92.05,3.05 2.64,2.84

### Footprints (pad centres in the part's own frame; a part is rotated, then mirrored left to right if it is on the bottom)
0805 = smd 0.8 x 1.2: 1 -0.9,0; 2 0.9,0
TQFP100 = smd 1.5 x 0.3: 1 -8,6; 2 -8,5.5; 3 -8,5; 4 -8,4.5; 5 -8,4; 6 -8,3.5; 7 -8,3; 8 -8,2.5; 9 -8,2; 10 -8,1.5; 11 -8,1; 12 -8,0.5; 13 -8,0; 14 -8,-0.5; 15 -8,-1; 16 -8,-1.5; 17 -8,-2; 18 -8,-2.5; 19 -8,-3; 20 -8,-3.5; 21 -8,-4; 22 -8,-4.5; 23 -8,-5; 24 -8,-5.5; 25 -8,-6; 51 8,-6; 52 8,-5.5; 53 8,-5; 54 8,-4.5; 55 8,-4; 56 8,-3.5; 57 8,-3; 58 8,-2.5; 59 8,-2; 60 8,-1.5; 61 8,-1; 62 8,-0.5; 63 8,0; 64 8,0.5; 65 8,1; 66 8,1.5; 67 8,2; 68 8,2.5; 69 8,3; 70 8,3.5; 71 8,4; 72 8,4.5; 73 8,5; 74 8,5.5; 75 8,6 | smd 0.3 x 1.5: 26 -6,-8; 27 -5.5,-8; 28 -5,-8; 29 -4.5,-8; 30 -4,-8; 31 -3.5,-8; 32 -3,-8; 33 -2.5,-8; 34 -2,-8; 35 -1.5,-8; 36 -1,-8; 37 -0.5,-8; 38 0,-8; 39 0.5,-8; 40 1,-8; 41 1.5,-8; 42 2,-8; 43 2.5,-8; 44 3,-8; 45 3.5,-8; 46 4,-8; 47 4.5,-8; 48 5,-8; 49 5.5,-8; 50 6,-8; 76 6,8; 77 5.5,8; 78 5,8; 79 4.5,8; 80 4,8; 81 3.5,8; 82 3,8; 83 2.5,8; 84 2,8; 85 1.5,8; 86 1,8; 87 0.5,8; 88 0,8; 89 -0.5,8; 90 -1,8; 91 -1.5,8; 92 -2,8; 93 -2.5,8; 94 -3,8; 95 -3.5,8; 96 -4,8; 97 -4.5,8; 98 -5,8; 99 -5.5,8; 100 -6,8
2X3 = drill 1.016 pad 1.88 octagon: 1 0,0; 2 0,2.54; 3 2.54,0; 4 2.54,2.54; 5 5.08,0; 6 5.08,2.54
SOT223 = smd 1.499 x 2.007: 1 -2.261,-3.15; 2 0.025,-3.15; 3 2.311,-3.15 | smd 3.81 x 2.007: 4 0,3.15
DPACK = smd 1 x 1.6: 1 -2.28,-4.8; 3 2.28,-4.8 | smd 5.4 x 6.2: 2 0,2.5
1X02_XTRA_BIG = drill 2.057 pad 3.556: 1 -2.54,0; 2 2.54,0
1X03 = drill 1.016 pad 1.88: 1 0,0; 2 2.54,0; 3 5.08,0
SOT23-3 = smd 0.8 x 0.9: 1 -0.95,-1; 2 0.95,-1; 3 0,1.1
TACTILE_SWITCH_SMD = smd 1.524 x 0.762: 1 -2.54,1.905; 2 2.54,1.905; 3 -2.54,-1.905; 4 2.54,-1.905
TQFP32-08 = smd 1.27 x 0.559: 1 -4.293,2.8; 2 -4.293,2; 3 -4.293,1.2; 4 -4.293,0.4; 5 -4.293,-0.4; 6 -4.293,-1.2; 7 -4.293,-2; 8 -4.293,-2.8; 17 4.293,-2.8; 18 4.293,-2; 19 4.293,-1.2; 20 4.293,-0.4; 21 4.293,0.4; 22 4.293,1.2; 23 4.293,2; 24 4.293,2.8 | smd 0.559 x 1.27: 9 -2.8,-4.293; 10 -2,-4.293; 11 -1.2,-4.293; 12 -0.4,-4.293; 13 0.4,-4.293; 14 1.2,-4.293; 15 2,-4.293; 16 2.8,-4.293; 25 2.8,4.293; 26 2,4.293; 27 1.2,4.293; 28 0.4,4.293; 29 -0.4,4.293; 30 -1.2,4.293; 31 -2,4.293; 32 -2.8,4.293
QFN-24 = smd 0.8 x 0.3: 1 -2,1.25; 2 -2,0.75; 3 -2,0.25; 4 -2,-0.25; 5 -2,-0.75; 6 -2,-1.25; 13 2,-1.25; 14 2,-0.75; 15 2,-0.25; 16 2,0.25; 17 2,0.75; 18 2,1.25 | smd 0.3 x 0.8: 7 -1.25,-2; 8 -0.75,-2; 9 -0.25,-2; 10 0.25,-2; 11 0.75,-2; 12 1.25,-2; 19 1.25,2; 20 0.75,2; 21 0.25,2; 22 -0.25,2; 23 -0.75,2; 24 -1.25,2
LGA14 = smd 0.5 x 1.2: 1 2,1.1; 2 1.2,1.1; 3 0.4,1.1; 4 -0.4,1.1; 5 -1.2,1.1; 6 -2,1.1; 8 -2,-1.1; 9 -1.2,-1.1; 10 -0.4,-1.1; 11 0.4,-1.1; 12 1.2,-1.1; 13 2,-1.1 | smd 1.2 x 0.5: 7 -2.1,0; 14 2.1,0
GP-2106 = smd 0.3 x 0.8: 1PPS -0.25,0; GND -0.75,0; ONOFF 0.25,0; RX 0.75,0; TX 1.25,0; VCC -1.25,0 | smd 0.4 x 0.8: P$7 -2.25,-2.5; P$8 2.25,-2.5
LGA28-5X5 = smd 0.7 x 0.4: 1 -2.3,1.65; 2 -2.3,1.1; 3 -2.3,0.55; 4 -2.3,0; 5 -2.3,-0.55; 6 -2.3,-1.1; 7 -2.3,-1.65; 15 2.3,-1.65; 16 2.3,-1.1; 17 2.3,-0.55; 18 2.3,0; 19 2.3,0.55; 20 2.3,1.1; 21 2.3,1.65 | smd 0.4 x 0.7: 8 -1.65,-2.3; 9 -1.1,-2.3; 10 -0.55,-2.3; 11 0,-2.3; 12 0.55,-2.3; 13 1.1,-2.3; 14 1.65,-2.3; 22 1.65,2.3; 23 1.1,2.3; 24 0.55,2.3; 25 0,2.3; 26 -0.55,2.3; 27 -1.1,2.3; 28 -1.65,2.3
BMP085 = smd 1.67 x 0.8: 1 -2.065,1.27; 2 -2.065,0; 3 -2.065,-1.27; 5 2.065,-1.27; 6 2.065,0; 7 2.065,1.27 | smd 0.8 x 1.67: 4 0,-2.065 | smd 0.8 x 2.5: 8 0,1.65
ESCPOWER = smd 6.452 x 3.251: GND 0,3.81; VIN 0,-5.08
RESONATOR-SMD = smd 0.7 x 1.7: 1 -1.2,0; 2 0,0; 3 1.2,0

### Placement (x,y rotation side)
C1  34.14,83.72 0 top
C2  59.33,62.59 0 top
C3  35.76,48.56 90 top
C4  34.14,81.28 0 top
C5  58.93,54.66 0 top
C6  58.93,52.22 0 top
C7  54.05,48.36 270 top
C8  49.58,52.63 180 top
C9  20.93,3.66 90 top
C10  78.44,70.92 0 top
C11  70.92,66.85 0 top
C12  34.14,78.84 0 top
C13  34.14,76.4 0 top
C14  74.37,37.39 90 top
C15  18.9,3.66 90 top
C16  16.87,3.66 90 top
C17  14.63,3.66 90 top
C18  76.81,37.39 90 top
C19  79.25,37.39 90 top
C20  81.69,37.39 90 top
C21  47.35,82.7 0 top
C22  56.29,82.7 0 top
C23  65.84,83.72 0 top
FCP  77.42,17.63 180 top
FCU_ISCP  86.97,32.72 0 top
IC2  64.82,76.61 180 top
IC4  47.35,78.03 180 top
IC7  56.29,77.83 180 top
IMU_ISCP  67.46,49.17 0 top
IMUP  19.51,16.97 45 top
JP1  58.93,89.81 90 top
M1  2.44,76.81 90 top
M2  92.05,76.4 90 top
M3  92.05,13.41 90 top
M4  2.64,13.41 90 top
NAV_ISCP  31.7,89 0 top
NAVP  19.05,79.45 270 top
Q1  70.92,73.96 0 top
Q2  70.92,69.9 0 top
Q3  50.19,57.51 0 top
Q4  53.64,57.51 180 top
R1  33.93,5.28 270 top
R2  31.29,5.28 270 top
R3  46.33,57.91 90 top
R4  73.96,66.85 0 top
R5  77.01,66.85 0 top
R6  87.38,72.95 90 top
R7  47.14,60.76 180 top
R8  47.14,62.38 180 top
R9  44.7,61.57 90 top
S1  90.22,67.46 0 top
U4  34.49,31.29 180 top
U5  49.58,48.36 90 top
U6  60.35,59.13 0 top
U7  52.63,60.76 180 top
U8  72.14,79.45 0 top
U$8  40.84,48.56 0 top
U$24  5.28,51.61 0 bottom
U$25  46.33,5.28 90 bottom
U$26  49.99,89.81 90 bottom
U$27  89.61,51.61 0 bottom
Y1  79.65,30.68 180 top
Y2  26.01,4.47 0 top
Y3  6.5,81.89 270 top
Y4  42.27,33.32 90 top

### Tracks (layer width: path | path; a pad name or v marks a point on that pad's centre or on a via)
1.8V  (14 unrouted)
3.3V  (19 unrouted)
5V  (41 unrouted)
  pour GND: 0,94.89 94.89,94.89 94.89,0.2 0,0.2
BUSCONTROL0  (3 unrouted)
BUSCONTROL1  (3 unrouted)
BUSCONTROL2  (3 unrouted)
BUSCONTROL3  (3 unrouted)
BUSCONTROL4  (3 unrouted)
BUSCONTROL5  (1 unrouted)
BUSCONTROL6  (1 unrouted)
BUSCONTROL7  (1 unrouted)
DATA0  (2 unrouted)
DATA1  (2 unrouted)
DATA2  (2 unrouted)
DATA3  (2 unrouted)
DATA4  (2 unrouted)
DATA5  (2 unrouted)
DATA6  (2 unrouted)
DATA7  (2 unrouted)
DATA8  (2 unrouted)
DATA9  (2 unrouted)
DATA10  (2 unrouted)
DATA11  (2 unrouted)
DATA12  (2 unrouted)
DATA13  (2 unrouted)
DATA14  (2 unrouted)
DATA15  (2 unrouted)
FCU_MISO  (1 unrouted)
FCU_MOSI  (1 unrouted)
FCU_SCK  (1 unrouted)
GND  (69 unrouted)
  pour Route15: 0,94.89 94.89,94.89 94.89,0.2 0,0.2
IMU_MISO  (1 unrouted)
IMU_MOSI  (1 unrouted)
IMU_SCK  (1 unrouted)
M1  (1 unrouted)
M2  (1 unrouted)
M3  (1 unrouted)
M4  (1 unrouted)
N$1  (1 unrouted)
N$2  (1 unrouted)
N$3  (1 unrouted)
N$4  (1 unrouted)
N$5  (1 unrouted)
N$6  (1 unrouted)
N$7  (1 unrouted)
N$8  (1 unrouted)
N$9  (2 unrouted)
N$10  (2 unrouted)
N$11  (3 unrouted)
N$12  (3 unrouted)
N$13  (1 unrouted)
N$14  (1 unrouted)
N$15  (1 unrouted)
NAV_MISO  (1 unrouted)
NAV_MOSI  (1 unrouted)
NAV_SCK  (1 unrouted)
RESET  (9 unrouted)
RX1  (2 unrouted)
SCL  (5 unrouted)
SDA  (5 unrouted)
TX1  (2 unrouted)
VIN  (5 unrouted)
  pour Bottom: 0.2,95.1 95.1,95.1 95.1,0.2 0.2,0.2